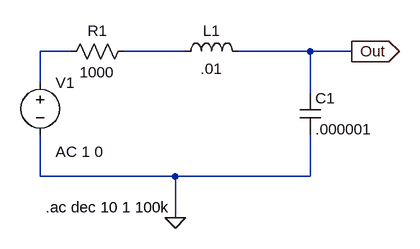
[diagram p0: schematic 2_AC_Sweep.asc]
2_AC_Sweep.asc, the LTspice schematic file:
Version 4
SHEET 1 1868 2100
WIRE -960 144 -1008 144
WIRE -784 144 -880 144
WIRE -592 144 -704 144
WIRE -528 144 -592 144
WIRE -1008 192 -1008 144
WIRE -592 208 -592 144
WIRE -1008 336 -1008 272
WIRE -800 336 -1008 336
WIRE -592 336 -592 272
WIRE -592 336 -800 336
WIRE -800 400 -800 336
FLAG -528 144 Out
IOPIN -528 144 Out
FLAG -800 400 0
SYMBOL res -864 128 R90
WINDOW 0 0 56 VBottom 2
WINDOW 3 32 56 VTop 2
SYMATTR InstName R1
SYMATTR Value 1000
SYMBOL ind -800 160 R270
WINDOW 0 32 56 VTop 2
WINDOW 3 5 56 VBottom 2
SYMATTR InstName L1
SYMATTR Value .01
SYMBOL cap -608 208 R0
SYMATTR InstName C1
SYMATTR Value .000001
SYMBOL voltage -1008 176 R0
WINDOW 123 24 122 Left 2
WINDOW 39 0 0 Left 0
SYMATTR InstName V1
SYMATTR Value ""
SYMATTR Value2 AC 1 0
TEXT -1000 384 Left 2 !.ac dec 10 1 100k

The netlist it stands for:
* 2_AC_Sweep.asc
R1 N002 N001 1000
L1 N002 Out .01
C1 Out 0 .000001
V1 N001 0 AC 1 0
.ac dec 10 1 100k
.backanno
.end

* Results of the author's LTspice run, read from the files saved beside the schematic
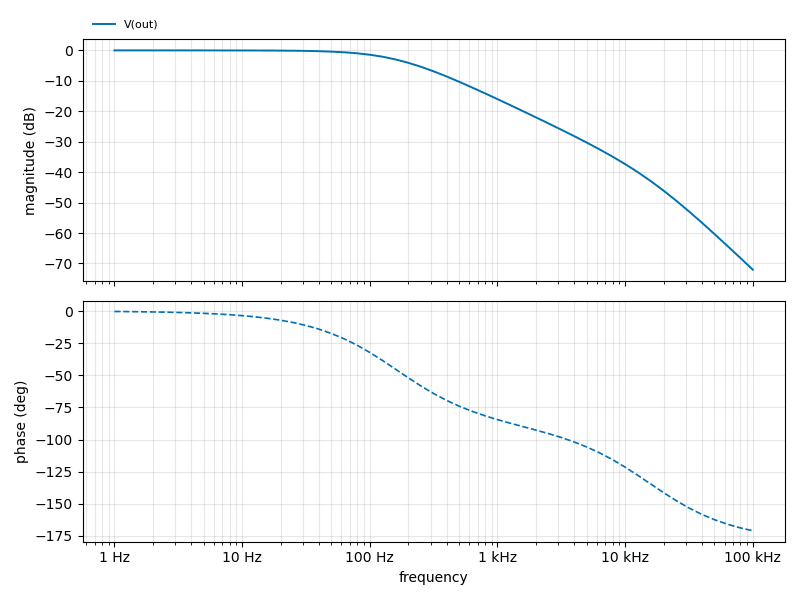
[diagram p1: AC Analysis of 2_AC_Sweep.asc, plotted from the saved traces]
* AC Analysis, 1 run:
*   V(out): -0.00 dB at 1 Hz, -72.03 dB at 100 kHz, peak -0.00 dB at 1 Hz, 3 dB below the peak at 160.5 Hz